# Altium schematic sheet Power Board.DCDC3V3.SchDoc
size A4; SheetNumber: 2; SheetTotal: 2
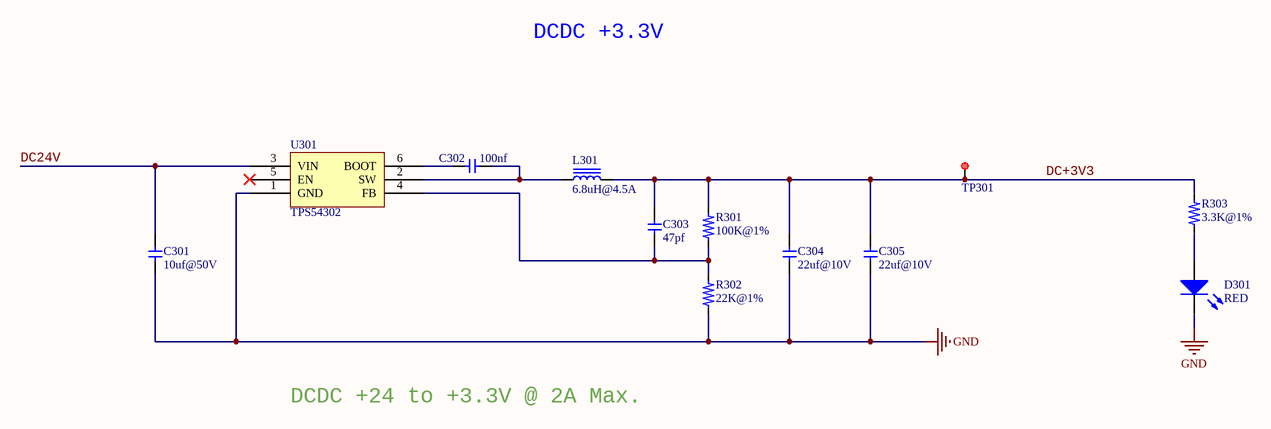
[diagram p0: Power Board.DCDC3V3.SchDoc]

## Parts
C301  value 10uf@50V  [C1206]  (hidden comment: Cap)
C302  value 100nf  [C0603]  (hidden comment: Cap)
C303  value 47pf  [C0603]  (hidden comment: Cap)
C304  value 22uf@10V  [C1206]  (hidden comment: Cap)
C305  value 22uf@10V  [C1206]  (hidden comment: Cap)
D301  value RED  [LED0603]  (hidden comment: LED)
L301  value 6.8uH@4.5A  [L06063]  (hidden comment: Inductor Iron)
R301  value 100K@1%  [R0603]  (hidden comment: Res)
R302  value 22K@1%  [R0603]  (hidden comment: Res)
R303  value 3.3K@1%  [R0603]  (hidden comment: Res)
TP301  TestPoint  [TestPoint-THM1.0-L]  (value not drawn)
U301  TPS54302  [TPS54302-SOT23-6]

## Nets
GND: C301.1 C304.1 C305.1 D301.2(K) R302.1 U301.1(GND)
DC24V: C301.2 U301.3(VIN)
DC+3V3: C303.1 C304.2 C305.2 L301.2 R301.2 R303.2 TP301.1
NetC302_1: C302.1 L301.1 U301.2(SW)
NetC302_2: C302.2 U301.6(BOOT)
NetC303_2: C303.2 R301.1 R302.2 U301.4(FB)
NetD301_1: D301.1(A) R303.1

Not connected (* = marked no-connect by the designer): U301 5(EN)*

## Notes on the sheet
- DCDC +3.3V
- DCDC +24 to +3.3V @ 2A Max.

## Library data of the parts
L301 = Inductor Iron: Magnetic-Core Inductor
R301-R303 = Res: 电阻
TP301 = TestPoint: 测试点
U301 = TPS54302: TPS54302 4.5-V to 28-V Input, 3-A Output, EMI-Friendly Synchronous Step-Down Converter